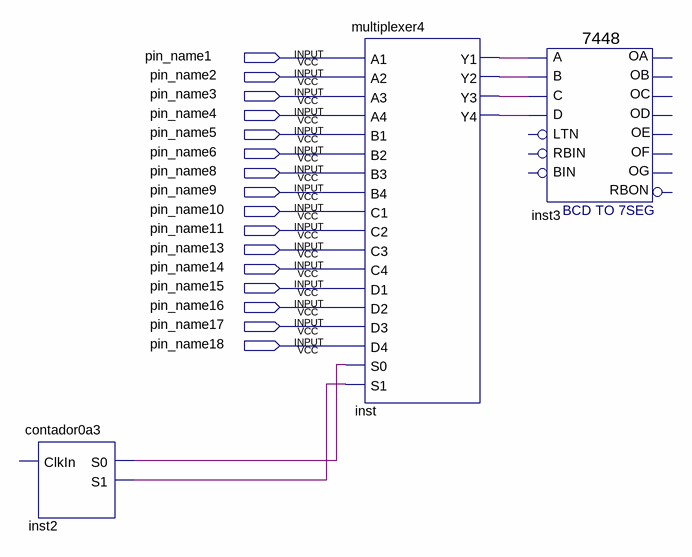
[diagram p0: schematic sheet]
// Quartus schematic DisplaySel2.bdf as structural Verilog: 3 symbols, 16 pins
module DisplaySel2 (
  input  pin_name1,
  input  pin_name2,
  input  pin_name3,
  input  pin_name4,
  input  pin_name5,
  input  pin_name6,
  input  pin_name8,
  input  pin_name9,
  input  pin_name10,
  input  pin_name11,
  input  pin_name13,
  input  pin_name14,
  input  pin_name15,
  input  pin_name16,
  input  pin_name17,
  input  pin_name18
);

  wire inst2_s0, inst2_s1, inst_y1, inst_y2, inst_y3, inst_y4;

  contador0a3 inst2 (.S0(inst2_s0), .S1(inst2_s1));  // open: ClkIn
  multiplexer4 inst (
    .A1(pin_name1), .A2(pin_name2), .A3(pin_name3), .A4(pin_name4), .B1(pin_name5), .B2(pin_name6),
    .B3(pin_name8), .B4(pin_name9), .C1(pin_name10), .C2(pin_name11), .C3(pin_name13), .C4(pin_name14),
    .D1(pin_name15), .D2(pin_name16), .D3(pin_name17), .D4(pin_name18), .S0(inst2_s0), .S1(inst2_s1),
    .Y1(inst_y1), .Y2(inst_y2), .Y3(inst_y3), .Y4(inst_y4));
  \7448  inst3 (
    .A(inst_y1), .C(inst_y3), .D(inst_y4), .B(inst_y2));  // open: RBIN, BIN, LTN, OC, OE, OD, OF, OG, OB, OA, RBON
endmodule
